# EAGLE design untitled (EAGLE 5.10)
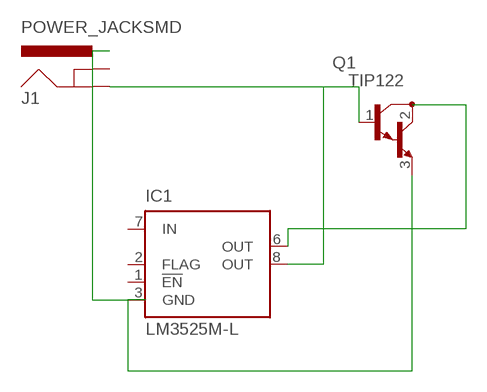
[diagram p0: schematic, sheet 1]

## Parts
IC1  LM3525M-L  [SO08]
J1  POWER_JACKSMD  [POWER_JACK_SMD]
Q1  TIP122  [TO220]

## Nets
N$1: IC1.8(OUT) J1.P$4(GND) Q1.1(B)
N$2: IC1.6(OUT) Q1.2(C)
N$3: J1.VIN0(PWR) Q1.3(E)
Unconnected: IC1.1(!EN) IC1.2(FLAG) IC1.4(NC) IC1.5(NC) IC1.7(IN) J1.GND(GNDBREAK)

## Power pins joined to a net without a drawn wire
GND: IC1.3(GND)

## Library data of the parts
IC1 = linear:LM3525M-L: Single Port USB Power Switch and Over-Current Protection LOW active Source: http://cache.national.com/ds/LM/LM3525.pdf
J1 = SparkFun:POWER_JACK: Power Jack This is the standard 5.5mm barrel jack for power. The PTH is the most common, proven, reliable, footprint. All others are experimental. The Slot footprint only works if the mill layer is transmitted to the PCB fab house so be warned. Spark Fun Electronics SKU : PRT-00119. Mating wall wart : TOL-00298 (and others)
Q1 = transistor-npn:TIP122*: NPN Darlington Transistor

## Board
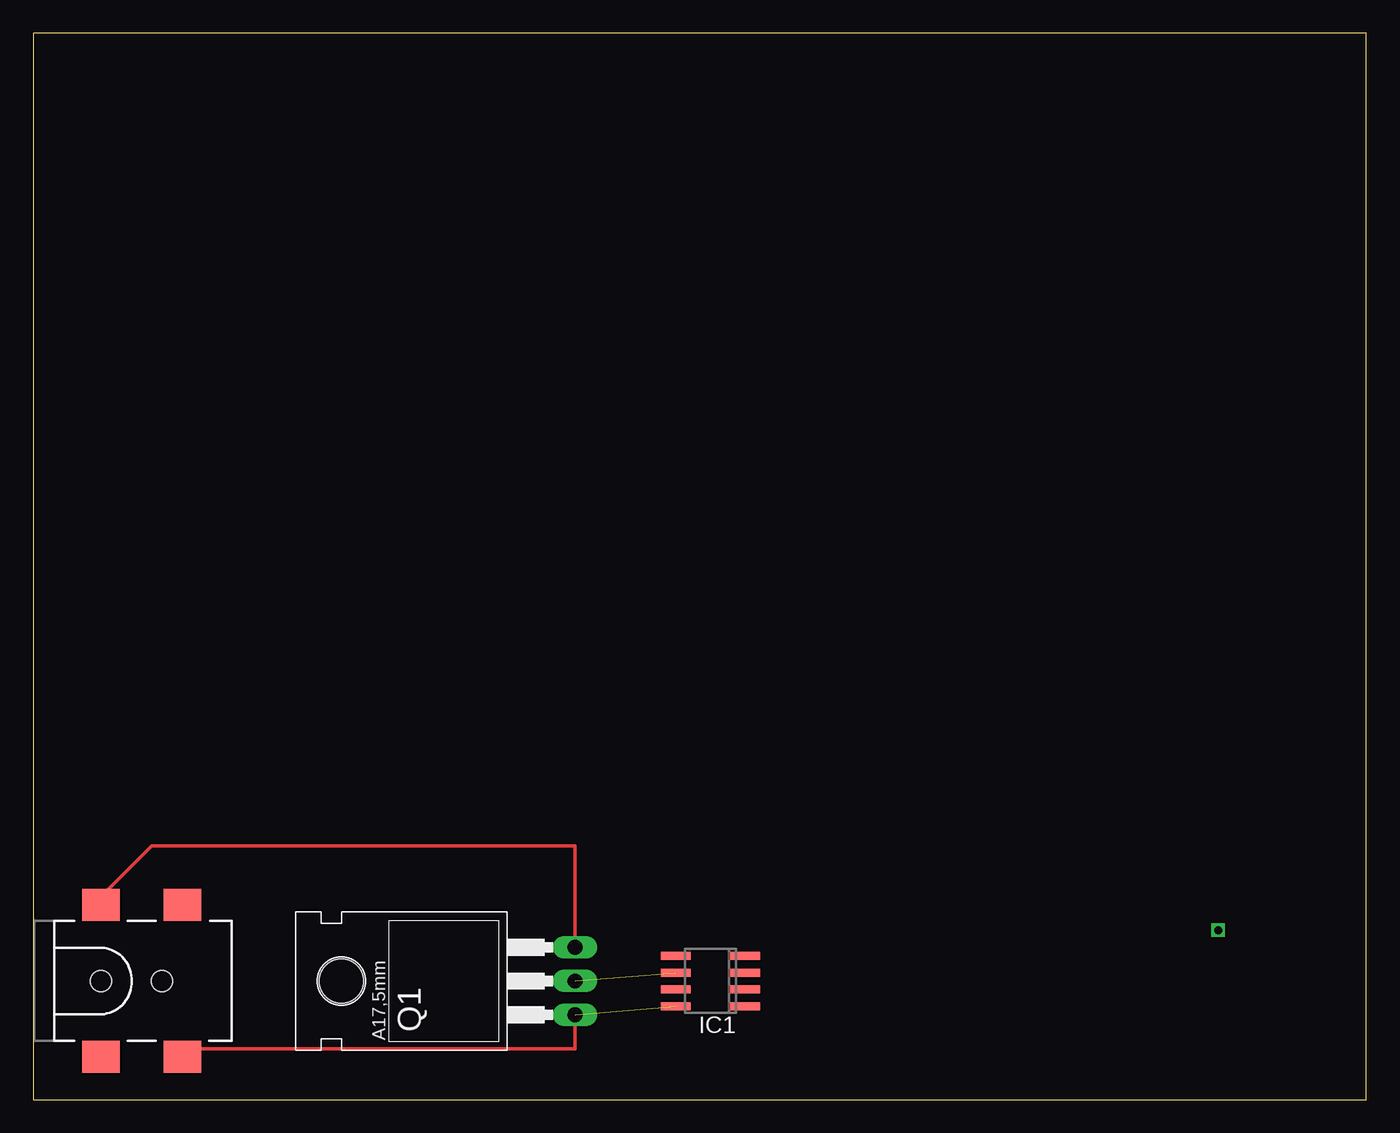
[diagram p1: board, top side]
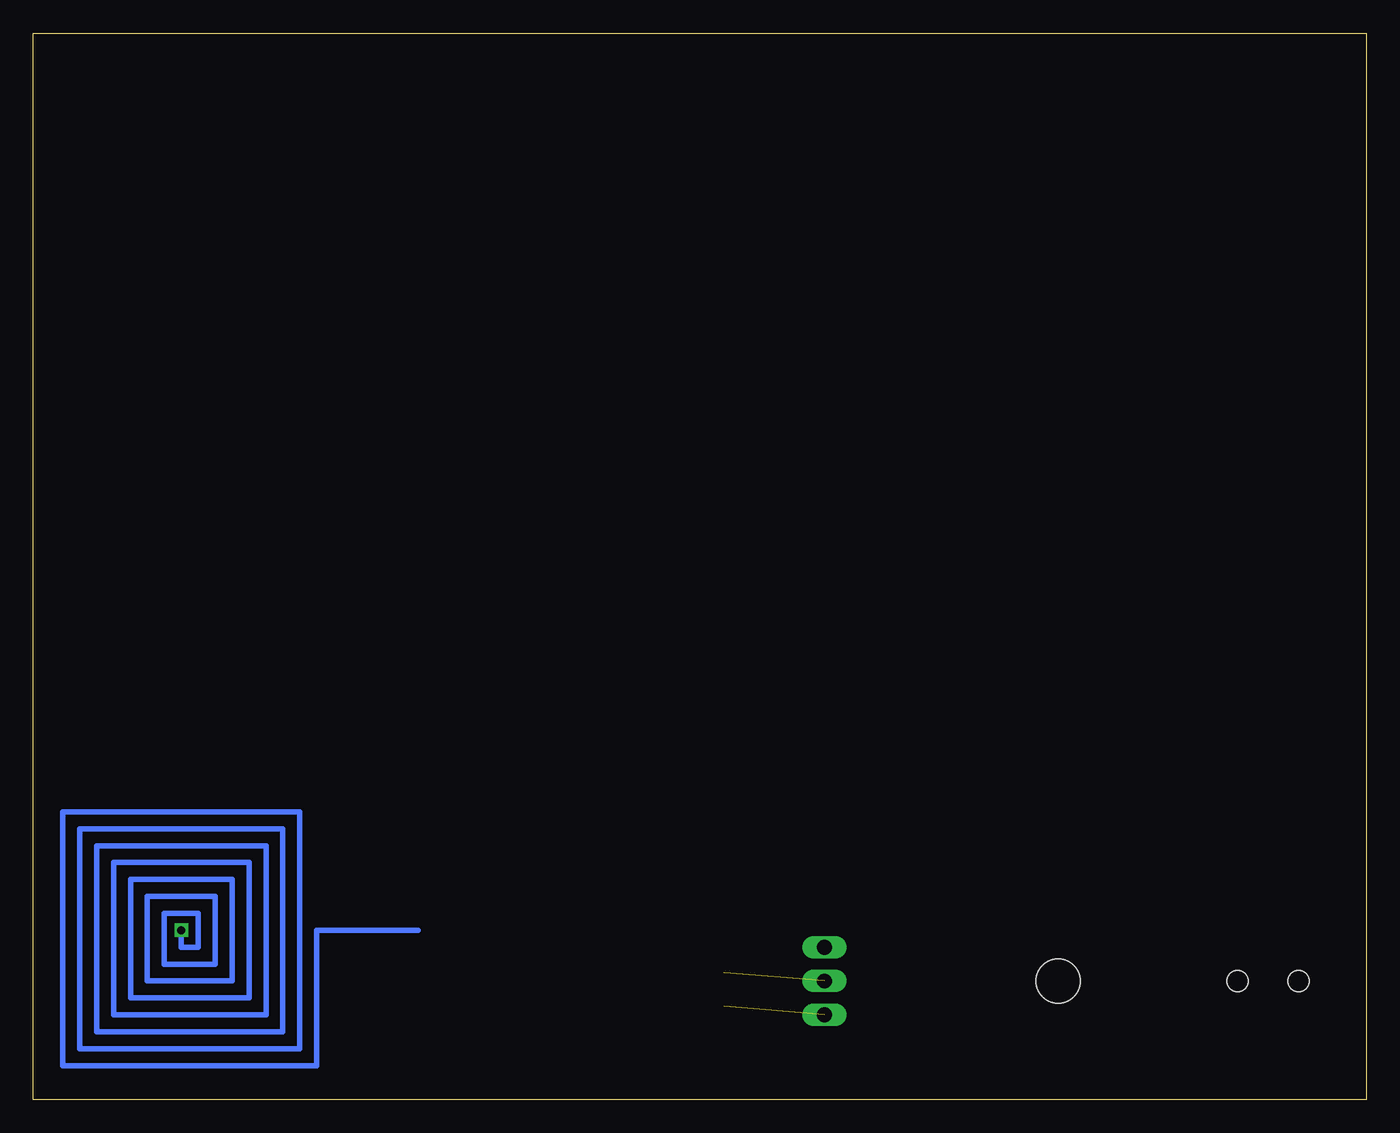
[diagram p2: board, bottom side, seen from below]

Size 100 x 80 mm. Coordinates in mm from the lower left corner, seen from the top.
Outline: 0,0 100,0 100,80 0,80 0,0
Copper layers (1*16): Top 0.035mm / dielectric 1.5mm / Bottom 0.035mm
Design rules "default": minimum track width 10mil, minimum drill 24mil, track to track 8mil, track to pad 8mil, pad to pad 8mil, via to via 8mil, smd to smd 8mil, copper to edge 40mil, drill to drill 8mil, minimum pad ring 10mil, minimum via ring 8mil, stop-mask expansion 4mil, vias tented up to drill 0mil, thermal gap 10mil

### Footprints (pad centres in the part's own frame; a part is rotated, then mirrored left to right if it is on the bottom)
SO08 = smd 0.6 x 2.2: 1 -1.905,-2.6; 2 -0.635,-2.6; 3 0.635,-2.6; 4 1.905,-2.6; 5 1.905,2.6; 6 0.635,2.6; 7 -0.635,2.6; 8 -1.905,2.6
POWER_JACK_SMD = smd 2.8 x 2.4: GND 0,-5.7; P$4 6.1,-5.7; VIN0 0,5.7; VIN1 6.1,5.7 | hole 1.6: 0,0; 4.572,0
TO220 = drill 1.118 long: 1 -2.54,-6.35; 2 0,-6.35; 3 2.54,-6.35 | hole 3.302: 0,11.176

### Placement (x,y rotation side)
IC1  50.8,8.89 90 top
J1  5.08,8.89 0 top
Q1  34.29,8.89 90 top

### Tracks (layer width: path | path; a pad name or v marks a point on that pad's centre or on a via)
N$1  (1 unrouted)
  Top 0.254: Q1.1 40.64,3.81 11.43,3.81 J1.P$4
N$2  (1 unrouted)
N$3
  Top 0.254: Q1.3 40.64,19.05 8.89,19.05 5.08,15.24 J1.VIN0
N$4  (via drill 0.6)
  Bottom 0.406: 71.12,12.7 78.74,12.7 78.74,2.54 97.79,2.54 97.79,21.59 80.01,21.59 80.01,3.81 96.52,3.81 96.52,20.32 81.28,20.32 81.28,5.08 95.25,5.08 95.25,19.05 82.55,19.05 82.55,6.35 93.98,6.35 93.98,17.78 83.82,17.78 83.82,7.62 92.71,7.62 92.71,16.51 85.09,16.51 85.09,8.89 91.44,8.89 91.44,15.24 86.36,15.24 86.36,10.16 90.17,10.16 90.17,13.97 87.63,13.97 87.63,11.43 88.9,11.43 v88.9,12.7